# EAGLE design 1A-LaunchPad_MiniProto (EAGLE 5.07)
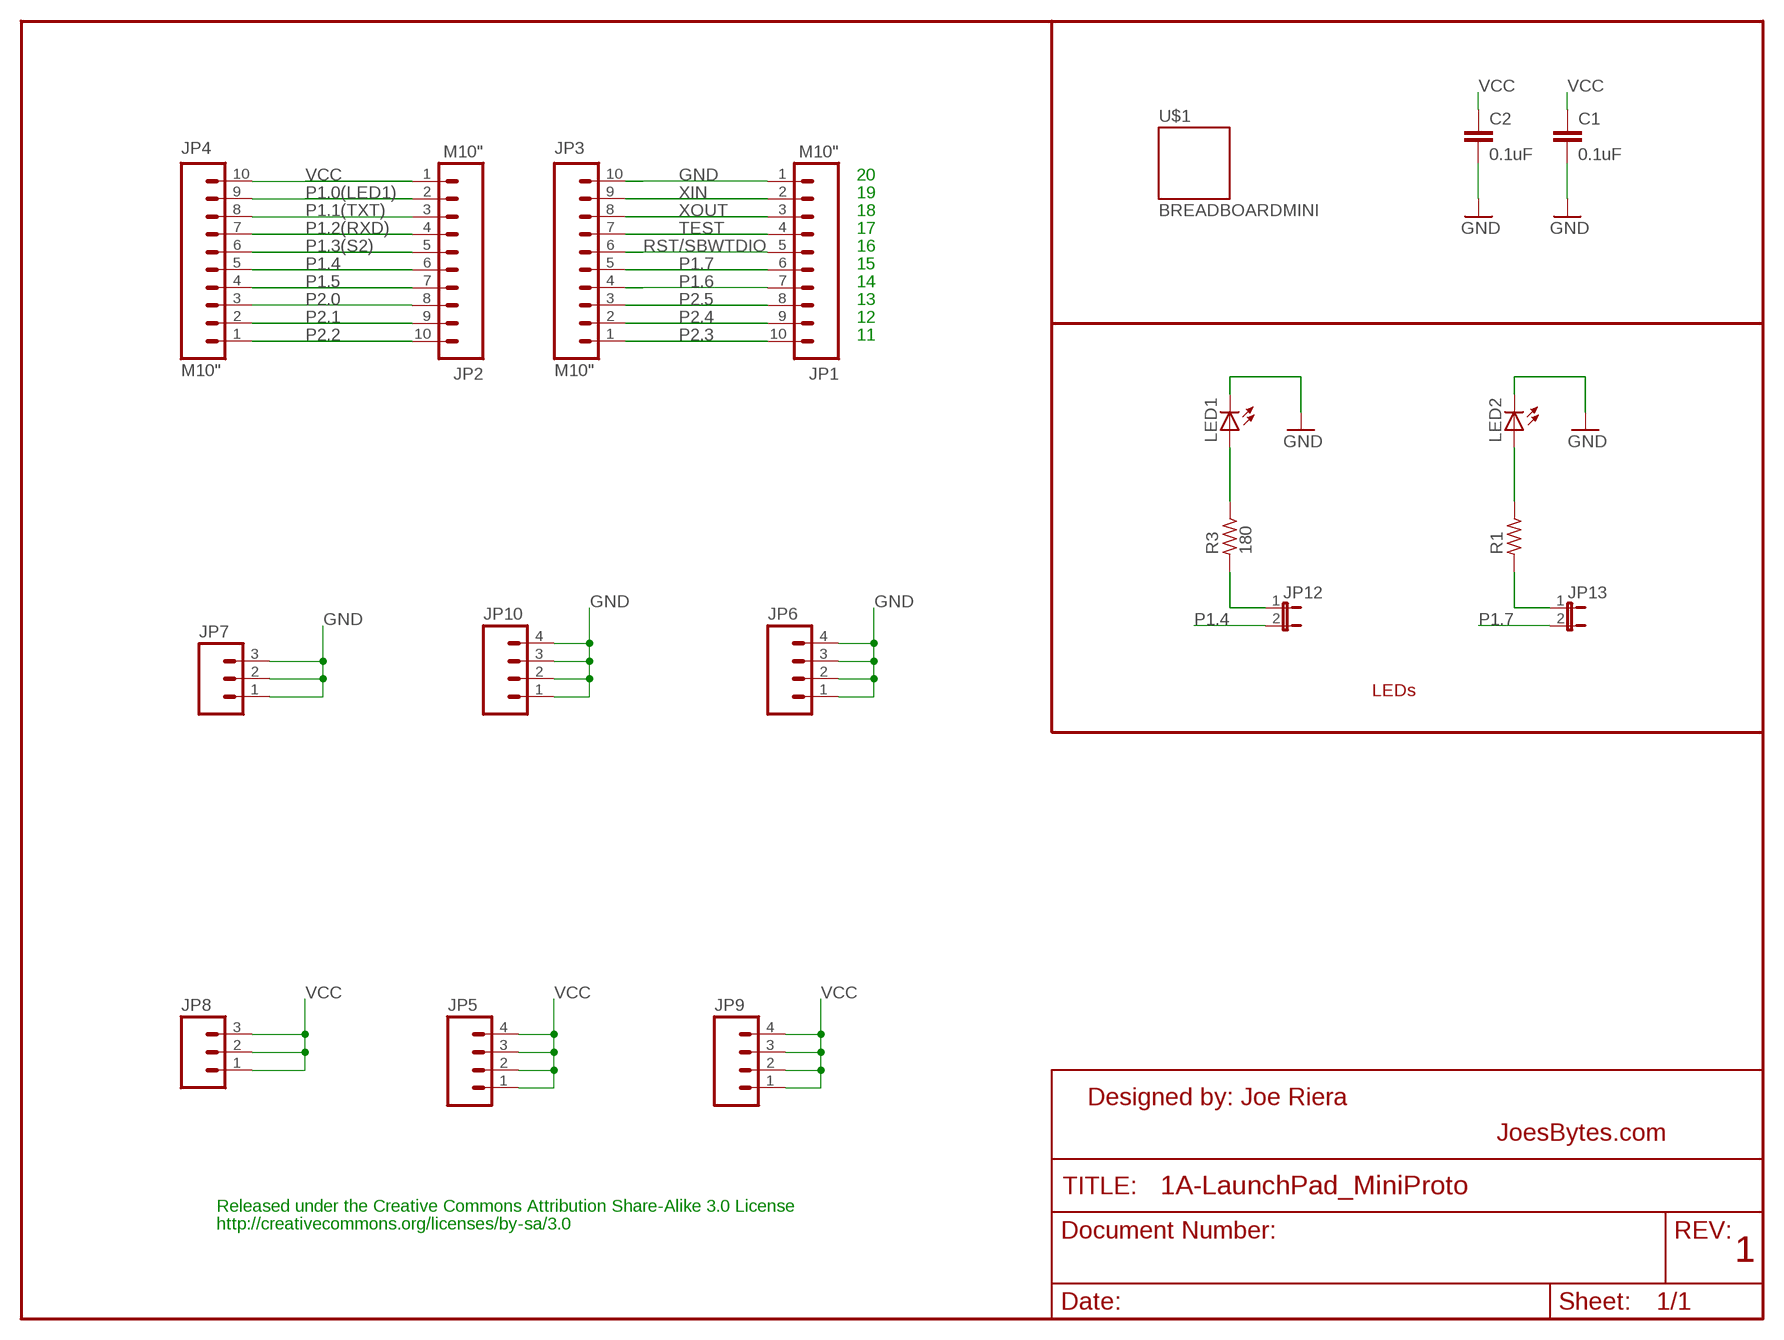
[diagram p0: schematic, sheet 1]

## Parts
C1  0.1uF  CAPPTH  [CAP-PTH-SMALL]
C2  0.1uF  CAPPTH  [CAP-PTH-SMALL]
JP1  M10"  [1X10]
JP2  M10"  [1X10]
JP3  M10"  [1X10]
JP4  M10"  [1X10]
JP5  M04PTH  [1X04]
JP6  M04PTH  [1X04]
JP7  M03PTH  [1X03]
JP8  M03PTH  [1X03]
JP9  M04PTH  [1X04]
JP10  M04PTH  [1X04]
JP12  JUMPER-2PTH_LOCK  [1X02_LOCK]
JP13  JUMPER-2PTH_LOCK  [1X02_LOCK]
LED1  LED3MM  [LED3MM]
LED2  LED3MM  [LED3MM]
R1  R_X0204/5  [0204/5]
R3  180  R_X0204/5  [0204/5]
U$1  BREADBOARDMINI  [BREADBOARD-MINI]

## Nets
GND: C1.2 C2.2 JP1.1 JP3.10 JP6.1 JP6.2 JP6.3 JP6.4 JP7.1 JP7.2 JP7.3 JP10.1 JP10.2 JP10.3 JP10.4 LED1.K(C) LED2.K(C)
N$188: LED1.A R3.2
N$204: JP12.1 R3.1
N$205: LED2.A R1.2
N$220: JP13.1 R1.1
P1.0(LED1): JP2.2 JP4.9
P1.1(TXT): JP2.3 JP4.8
P1.2(RXD): JP2.4 JP4.7
P1.3(S2): JP2.5 JP4.6
P1.4: JP2.6 JP4.5 JP12.2
P1.5: JP2.7 JP4.4
P1.6: JP1.7 JP3.4
P1.7: JP1.6 JP3.5 JP13.2
P2.0: JP2.8 JP4.3
P2.1: JP2.9 JP4.2
P2.2: JP2.10 JP4.1
P2.3: JP1.10 JP3.1
P2.4: JP1.9 JP3.2
P2.5: JP1.8 JP3.3
RST/SBWTDIO: JP1.5 JP3.6
TEST: JP1.4 JP3.7
VCC: C1.1 C2.1 JP2.1 JP4.10 JP5.1 JP5.2 JP5.3 JP5.4 JP8.1 JP8.2 JP8.3 JP9.1 JP9.2 JP9.3 JP9.4
XIN: JP1.2 JP3.9
XOUT: JP1.3 JP3.8

## Notes on the sheet
- 20
- 19
- 18
- 17
- 16
- 15
- 14
- 13
- 12
- 11
- LEDs
- Designed by: Joe Riera
- JoesBytes.com
- Released under the Creative Commons Attribution Share-Alike 3.0 License
- http://creativecommons.org/licenses/by-sa/3.0
- 1

## Library data of the parts
C1 C2 = SparkFun:CAP: Capacitor Standard 0603 ceramic capacitor, and 0.1" leaded capacitor.
JP1-JP4 = SparkFun:M10: Header 10 Standard 10-pin 0.1" header. Use with straight break away headers (SKU : PRT-00116), right angle break away headers (PRT-00553), swiss pins (PRT-00743), machine pins (PRT-00117), and female headers (PRT-00115).
JP5 JP6 JP9 JP10 = SparkFun:M04: Header 4 Standard 4-pin 0.1" header. Use with straight break away headers (SKU : PRT-00116), right angle break away headers (PRT-00553), swiss pins (PRT-00743), machine pins (PRT-00117), and female headers (PRT-00115). Molex polarized connector foot print use with SKU : PRT-08231 with associated crimp pins and housings.
JP7 JP8 = SparkFun:M03: Header 3 Standard 3-pin 0.1" header. Use with straight break away headers (SKU : PRT-00116), right angle break away headers (PRT-00553), swiss pins (PRT-00743), machine pins (PRT-00117), and female headers (PRT-00115). Molex polarized connector foot print use with SKU : PRT-08232 with associated crimp pins and housings.
JP12 JP13 = SparkFun:JUMPER-2: Jumper Basic 0.1" spaced jumper. Use with breakaway headers.
LED1 LED2 = SparkFun:LED: LEDs Standard schematic elements and footprints for 5mm, 3mm, 1206, and 0603 sized LEDs. 5mm - Spark Fun Electronics SKU : COM-00529 (and others)
R1 R3 = rc-master:R_: RESISTOR
U$1 = SparkFun:BREADBOARD: Breadboard Mini Self Adhesive This is the mechnical outline for the very small self adhesive breadboard from SparkFun Electronics. Good for very small proto areas. SKU : PRT-07916

## Board
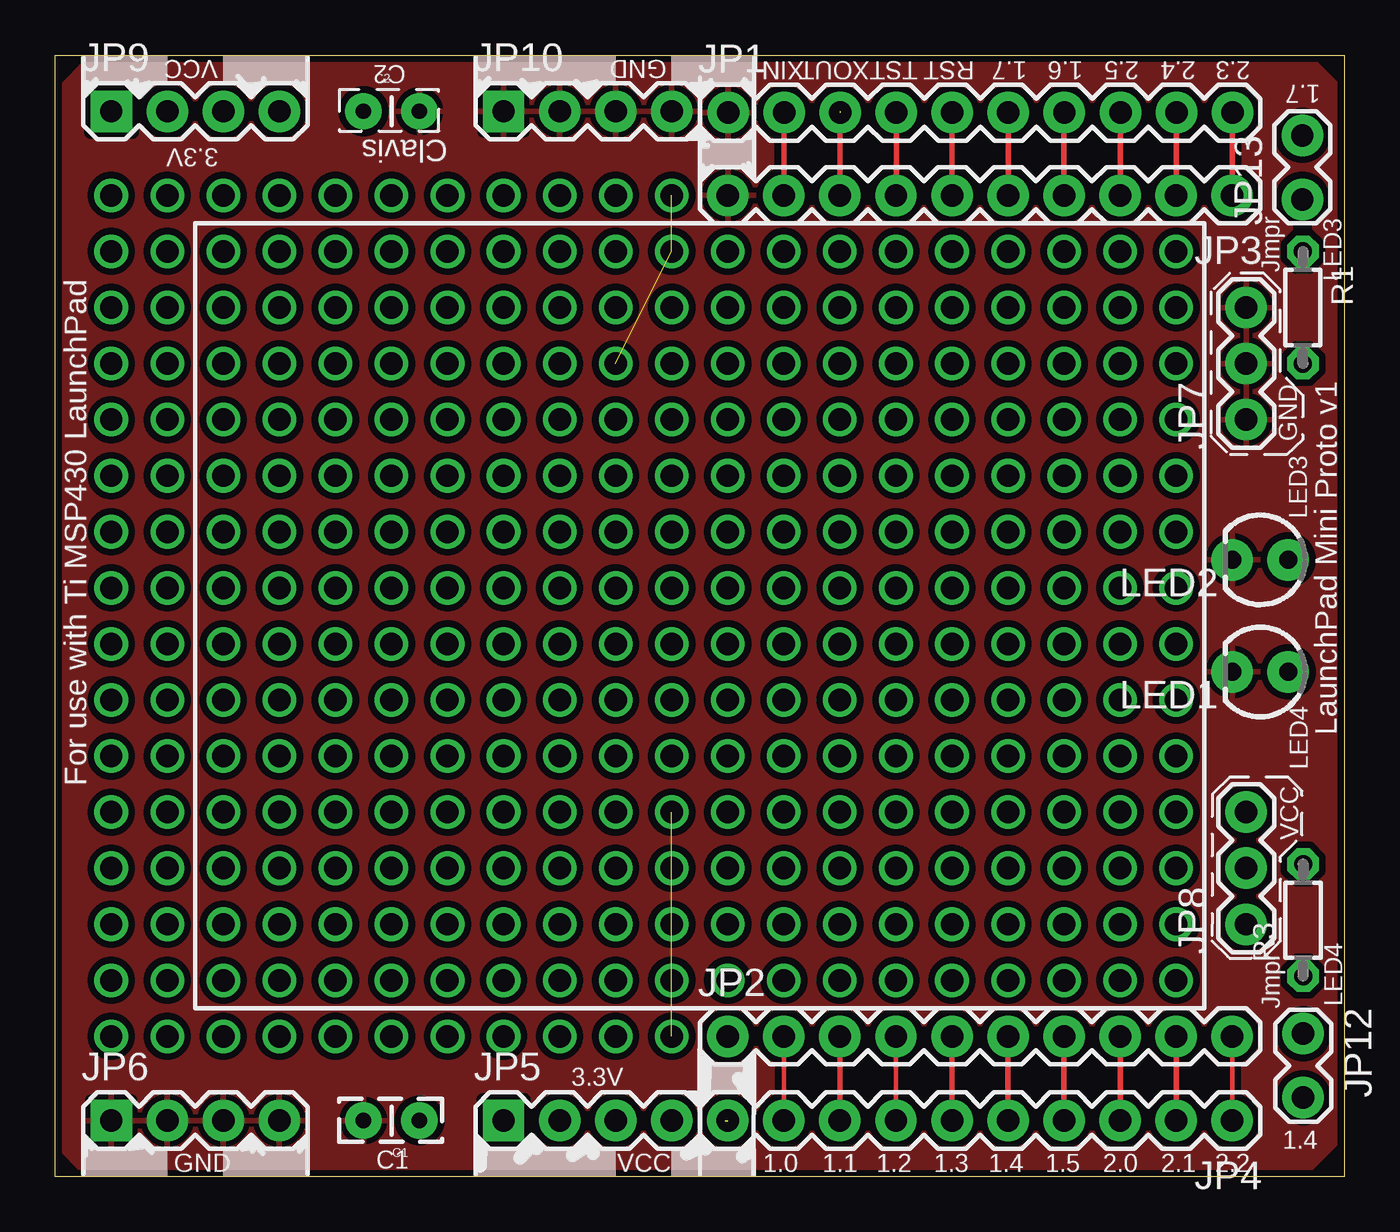
[diagram p1: board, top side]
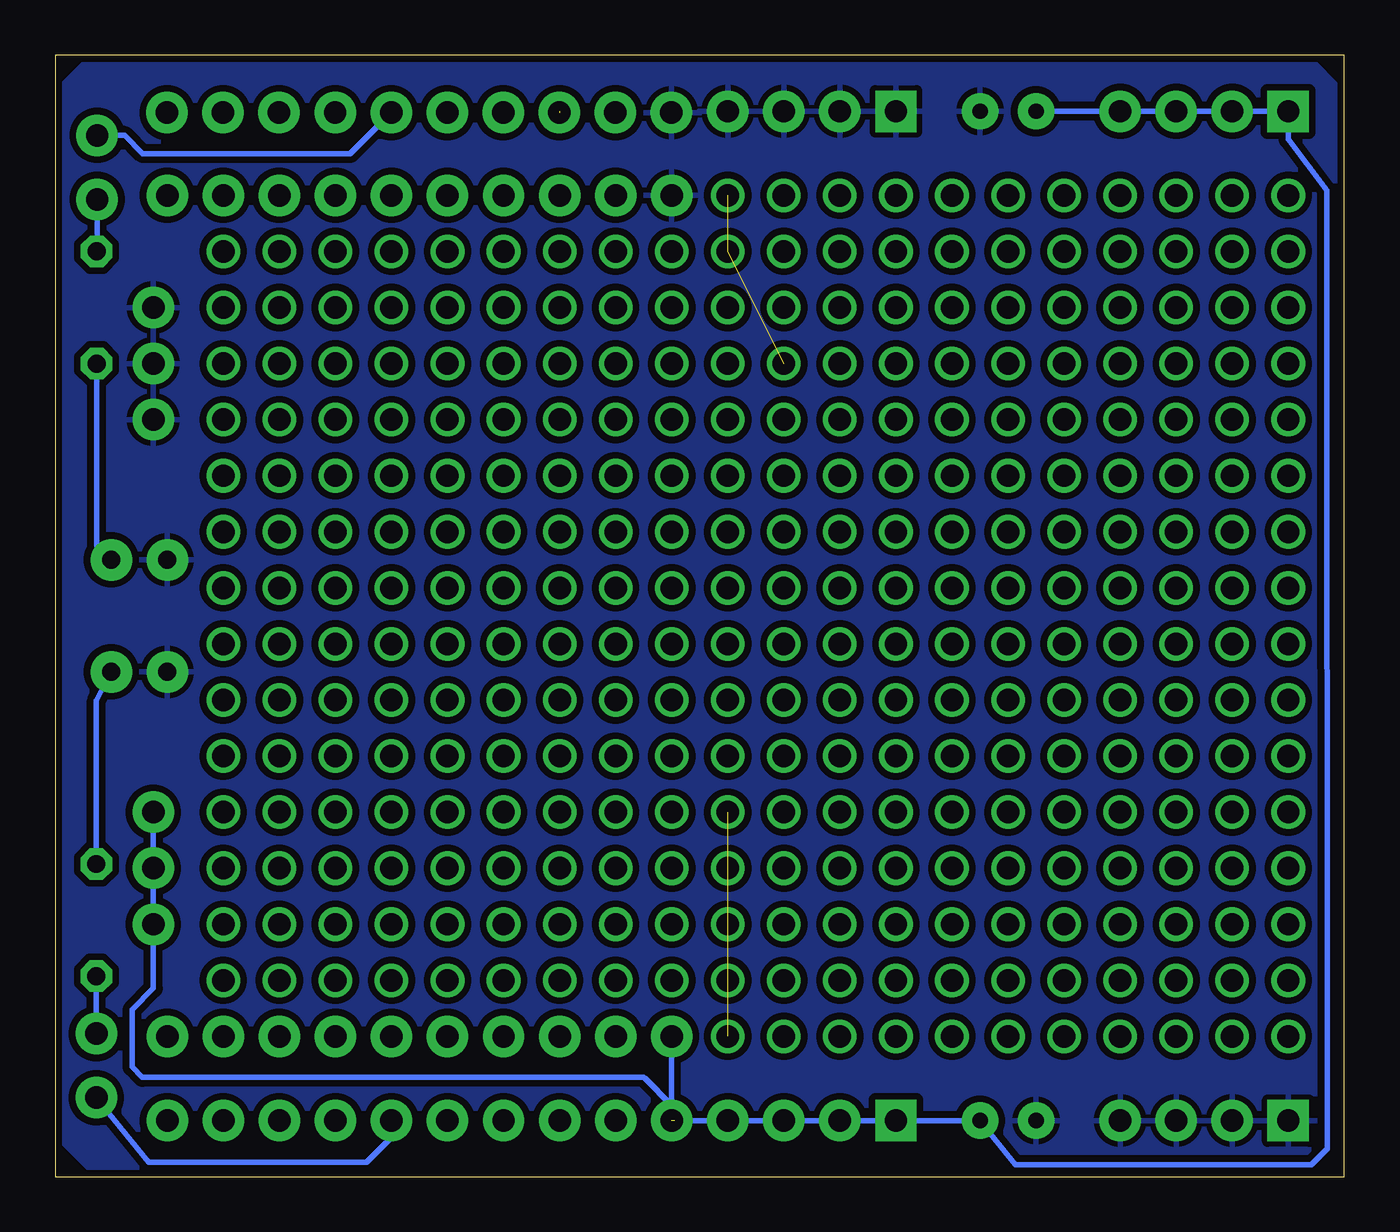
[diagram p2: board, bottom side, seen from below]

Size 58.42 x 50.8 mm. Coordinates in mm from the lower left corner, seen from the top.
Outline: 0,0 0,50.8 58.42,50.8 58.42,0 0,0
Copper layers (1*16): Top 0.035mm / dielectric 1.5mm / Bottom 0.035mm
Design rules "SparkFun": minimum track width 8mil, minimum drill 20mil, track to track 8mil, track to pad 8mil, pad to pad 8mil, via to via 8mil, smd to smd 8mil, copper to edge 10mil, drill to drill 8mil, minimum pad ring 12mil, minimum via ring 10mil, stop-mask expansion 4mil, vias tented up to drill 25mil, thermal gap 10mil

### Footprints (pad centres in the part's own frame; a part is rotated, then mirrored left to right if it is on the bottom)
CAP-PTH-SMALL = drill 0.7 pad 1.651 round: 1 0,0; 2 2.54,0
1X10 = drill 1.016 pad 1.88 round: 1 0,0; 2 2.54,0; 3 5.08,0; 4 7.62,0; 5 10.16,0; 6 12.7,0; 7 15.24,0; 8 17.78,0; 9 20.32,0; 10 22.86,0
1X04 = drill 1.016 pad 1.88 square: 1 0,0 | drill 1.016 pad 1.88 round: 2 2.54,0; 3 5.08,0; 4 7.62,0
1X03 = drill 1.016 pad 1.88 round: 1 0,0; 2 2.54,0; 3 5.08,0
1X02_LOCK = drill 1.016 pad 1.88 round: 1 -0.178,0; 2 2.718,0
LED3MM = drill 0.813 pad 1.88 round: A -1.27,0; K 1.27,0
0204/5 = drill 0.813 pad 1.422 octagon: 1 -2.54,0; 2 2.54,0

### Placement (x,y rotation side)
C1  16.51,2.54 180 top
C2  13.97,48.26 0 top
JP1  30.49,48.2 0 top
JP2  30.48,6.35 0 top
JP3  53.34,44.45 180 top
JP4  53.34,2.54 180 top
JP5  20.32,2.54 0 top
JP6  2.54,2.54 0 top
JP7  53.98,34.29 90 top
JP8  53.98,11.43 90 top
JP9  2.54,48.26 0 top
JP10  20.32,48.26 0 top
JP12  56.55,6.3 270 top
JP13  56.52,44.45 90 top
LED1  54.61,22.86 180 top
LED2  54.61,27.94 180 top
R1  56.54,39.37 270 top
R3  56.55,11.62 90 top
U$1  6.35,7.62 0 top

### Tracks (layer width: path | path; a pad name or v marks a point on that pad's centre or on a via)
GND
  pour Top (isolate 0.305): 1.75,50.81 56.71,50.81 58.46,49.06 58.46,1.96 56.5,0 1.55,0 0,1.55 0,49.06
  pour Bottom (isolate 0.305): 1.75,50.81 56.71,50.81 58.46,49.06 58.46,1.96 56.5,0 1.55,0 0,1.55 0,49.06
N$2  (via drill 1.02 pad 1.52)
  other vias: 5.08,41.91
N$3  (via drill 1.02 pad 1.52)
  other vias: 7.62,41.91
N$5  (via drill 1.02 pad 1.52)
  other vias: 50.8,21.59
N$7  (via drill 1.02 pad 1.52)
  other vias: 10.16,41.91
N$8  (via drill 1.02 pad 1.52)
  other vias: 10.16,39.37
N$13  (via drill 1.02 pad 1.52)
  other vias: 48.26,39.37
N$15  (via drill 1.02 pad 1.52)
  other vias: 2.54,41.91
N$16  (via drill 1.02 pad 1.52)
  other vias: 2.54,39.37
N$17  (via drill 1.02 pad 1.52)
  other vias: 2.54,31.75
N$18  (via drill 1.02 pad 1.52)
  other vias: 2.54,34.29
N$19  (via drill 1.02 pad 1.52)
  other vias: 2.54,36.83
N$20  (via drill 1.02 pad 1.52)
  other vias: 12.7,44.45
N$21  (via drill 1.02 pad 1.52)
  other vias: 15.24,44.45
N$22  (via drill 1.02 pad 1.52)
  other vias: 17.78,44.45
N$23  (via drill 1.02 pad 1.52)
  other vias: 20.32,44.45
N$24  (via drill 1.02 pad 1.52)
  other vias: 22.86,44.45
N$25  (via drill 1.02 pad 1.52)
  other vias: 45.72,39.37
N$26  (via drill 1.02 pad 1.52)
  other vias: 43.18,39.37
N$27  (via drill 1.02 pad 1.52)
  other vias: 40.64,39.37
N$28  (via drill 1.02 pad 1.52)
  other vias: 38.1,39.37
N$29  (via drill 1.02 pad 1.52)
  other vias: 35.56,39.37
N$30  (via drill 1.02 pad 1.52)
  other vias: 33.02,39.37
N$31  (via drill 1.02 pad 1.52)
  other vias: 30.48,39.37
N$32  (via drill 1.02 pad 1.52)
  other vias: 30.48,41.91
N$33  (via drill 1.02 pad 1.52)
  other vias: 7.62,39.37
N$34  (via drill 1.02 pad 1.52)
  other vias: 5.08,39.37
N$35  (via drill 1.02 pad 1.52)
  other vias: 5.08,31.75
N$36  (via drill 1.02 pad 1.52)
  other vias: 7.62,31.75
N$37  (via drill 1.02 pad 1.52)
  other vias: 10.16,31.75
N$38  (via drill 1.02 pad 1.52)
  other vias: 10.16,34.29
N$39  (via drill 1.02 pad 1.52)
  other vias: 7.62,34.29
N$40  (via drill 1.02 pad 1.52)
  other vias: 5.08,34.29
N$41  (via drill 1.02 pad 1.52)
  other vias: 30.48,31.75
N$42  (via drill 1.02 pad 1.52)
  other vias: 33.02,31.75
N$43  (via drill 1.02 pad 1.52)
  other vias: 35.56,31.75
N$44  (via drill 1.02 pad 1.52)
  other vias: 38.1,31.75
N$45  (via drill 1.02 pad 1.52)
  other vias: 40.64,31.75
N$46  (via drill 1.02 pad 1.52)
  other vias: 43.18,31.75
N$47  (via drill 1.02 pad 1.52)
  other vias: 45.72,31.75
N$48  (via drill 1.02 pad 1.52)
  other vias: 48.26,31.75
N$49  (via drill 1.02 pad 1.52)
  other vias: 48.26,34.29
N$50  (via drill 1.02 pad 1.52)
  other vias: 45.72,34.29
N$51  (via drill 1.02 pad 1.52)
  other vias: 43.18,34.29
N$52  (via drill 1.02 pad 1.52)
  other vias: 40.64,34.29
N$53  (via drill 1.02 pad 1.52)
  other vias: 38.1,34.29
N$54  (via drill 1.02 pad 1.52)
  other vias: 35.56,34.29
N$55  (via drill 1.02 pad 1.52)
  other vias: 33.02,34.29
N$56  (via drill 1.02 pad 1.52)
  other vias: 30.48,34.29
N$57  (via drill 1.02 pad 1.52)
  other vias: 5.08,36.83
N$58  (via drill 1.02 pad 1.52)
  other vias: 7.62,36.83
N$59  (via drill 1.02 pad 1.52)
  other vias: 10.16,36.83
N$60  (via drill 1.02 pad 1.52)
  other vias: 10.16,29.21
N$61  (via drill 1.02 pad 1.52)
  other vias: 7.62,29.21
N$62  (via drill 1.02 pad 1.52)
  other vias: 5.08,29.21
N$63  (via drill 1.02 pad 1.52)
  other vias: 5.08,26.67
N$64  (via drill 1.02 pad 1.52)
  other vias: 7.62,26.67
N$65  (via drill 1.02 pad 1.52)
  other vias: 30.48,36.83
N$66  (via drill 1.02 pad 1.52)
  other vias: 33.02,36.83
N$67  (via drill 1.02 pad 1.52)
  other vias: 35.56,36.83
N$68  (via drill 1.02 pad 1.52)
  other vias: 38.1,36.83
N$69  (via drill 1.02 pad 1.52)
  other vias: 40.64,36.83
N$70  (via drill 1.02 pad 1.52)
  other vias: 43.18,36.83
N$71  (via drill 1.02 pad 1.52)
  other vias: 45.72,36.83
N$72  (via drill 1.02 pad 1.52)
  other vias: 48.26,36.83
N$73  (via drill 1.02 pad 1.52)
  other vias: 48.26,29.21
N$74  (via drill 1.02 pad 1.52)
  other vias: 45.72,29.21
N$75  (via drill 1.02 pad 1.52)
  other vias: 43.18,29.21
N$76  (via drill 1.02 pad 1.52)
  other vias: 40.64,29.21
N$77  (via drill 1.02 pad 1.52)
  other vias: 38.1,29.21
N$78  (via drill 1.02 pad 1.52)
  other vias: 35.56,29.21
N$79  (via drill 1.02 pad 1.52)
  other vias: 33.02,29.21
N$80  (via drill 1.02 pad 1.52)
  other vias: 30.48,29.21
N$81  (via drill 1.02 pad 1.52)
  other vias: 10.16,26.67
N$82  (via drill 1.02 pad 1.52)
  other vias: 10.16,24.13
N$83  (via drill 1.02 pad 1.52)
  other vias: 7.62,24.13
N$84  (via drill 1.02 pad 1.52)
  other vias: 5.08,24.13
N$85  (via drill 1.02 pad 1.52)
  other vias: 5.08,16.51
N$86  (via drill 1.02 pad 1.52)
  other vias: 7.62,16.51
N$87  (via drill 1.02 pad 1.52)
  other vias: 10.16,16.51
N$88  (via drill 1.02 pad 1.52)
  other vias: 10.16,19.05
N$89  (via drill 1.02 pad 1.52)
  other vias: 30.48,26.67
N$90  (via drill 1.02 pad 1.52)
  other vias: 33.02,26.67
N$91  (via drill 1.02 pad 1.52)
  other vias: 35.56,26.67
N$92  (via drill 1.02 pad 1.52)
  other vias: 38.1,26.67
N$93  (via drill 1.02 pad 1.52)
  other vias: 40.64,26.67
N$94  (via drill 1.02 pad 1.52)
  other vias: 43.18,26.67
N$95  (via drill 1.02 pad 1.52)
  other vias: 45.72,26.67
N$96  (via drill 1.02 pad 1.52)
  other vias: 48.26,26.67
N$97  (via drill 1.02 pad 1.52)
  other vias: 48.26,24.13
N$98  (via drill 1.02 pad 1.52)
  other vias: 45.72,24.13
N$99  (via drill 1.02 pad 1.52)
  other vias: 43.18,24.13
N$100  (via drill 1.02 pad 1.52)
  other vias: 40.64,24.13
N$101  (via drill 1.02 pad 1.52)
  other vias: 38.1,24.13
N$102  (via drill 1.02 pad 1.52)
  other vias: 35.56,24.13
N$103  (via drill 1.02 pad 1.52)
  other vias: 33.02,24.13
N$104  (via drill 1.02 pad 1.52)
  other vias: 30.48,24.13
N$105  (via drill 1.02 pad 1.52)
  other vias: 7.62,19.05
N$106  (via drill 1.02 pad 1.52)
  other vias: 5.08,19.05
N$107  (via drill 1.02 pad 1.52)
  other vias: 5.08,21.59
N$108  (via drill 1.02 pad 1.52)
  other vias: 7.62,21.59
N$109  (via drill 1.02 pad 1.52)
  other vias: 10.16,21.59
N$110  (via drill 1.02 pad 1.52)
  other vias: 5.08,8.89
N$111  (via drill 1.02 pad 1.52)
  other vias: 7.62,8.89
N$112  (via drill 1.02 pad 1.52)
  other vias: 10.16,8.89
N$113  (via drill 1.02 pad 1.52)
  other vias: 30.48,16.51
N$114  (via drill 1.02 pad 1.52)
  other vias: 33.02,16.51
N$115  (via drill 1.02 pad 1.52)
  other vias: 35.56,16.51
N$116  (via drill 1.02 pad 1.52)
  other vias: 38.1,16.51
N$117  (via drill 1.02 pad 1.52)
  other vias: 40.64,16.51
N$118  (via drill 1.02 pad 1.52)
  other vias: 43.18,16.51
N$119  (via drill 1.02 pad 1.52)
  other vias: 45.72,16.51
N$120  (via drill 1.02 pad 1.52)
  other vias: 48.26,16.51
N$121  (via drill 1.02 pad 1.52)
  other vias: 48.26,19.05
N$122  (via drill 1.02 pad 1.52)
  other vias: 45.72,19.05
N$123  (via drill 1.02 pad 1.52)
  other vias: 43.18,19.05
N$124  (via drill 1.02 pad 1.52)
  other vias: 40.64,19.05
N$125  (via drill 1.02 pad 1.52)
  other vias: 38.1,19.05
N$126  (via drill 1.02 pad 1.52)
  other vias: 35.56,19.05
N$127  (via drill 1.02 pad 1.52)
  other vias: 33.02,19.05
N$128  (via drill 1.02 pad 1.52)
  other vias: 30.48,19.05
N$129  (via drill 1.02 pad 1.52)
  other vias: 10.16,11.43
N$130  (via drill 1.02 pad 1.52)
  other vias: 7.62,11.43
N$131  (via drill 1.02 pad 1.52)
  other vias: 5.08,11.43
N$132  (via drill 1.02 pad 1.52)
  other vias: 5.08,13.97
N$133  (via drill 1.02 pad 1.52)
  other vias: 7.62,13.97
N$134  (via drill 1.02 pad 1.52)
  other vias: 10.16,13.97
N$135  (via drill 1.02 pad 1.52)
  other vias: 2.54,29.21
N$136  (via drill 1.02 pad 1.52)
  other vias: 2.54,26.67
N$137  (via drill 1.02 pad 1.52)
  other vias: 30.48,21.59
N$138  (via drill 1.02 pad 1.52)
  other vias: 33.02,21.59
N$139  (via drill 1.02 pad 1.52)
  other vias: 35.56,21.59
N$140  (via drill 1.02 pad 1.52)
  other vias: 38.1,21.59
N$141  (via drill 1.02 pad 1.52)
  other vias: 40.64,21.59
N$142  (via drill 1.02 pad 1.52)
  other vias: 43.18,21.59
N$143  (via drill 1.02 pad 1.52)
  other vias: 45.72,21.59
N$144  (via drill 1.02 pad 1.52)
  other vias: 48.26,21.59
N$145  (via drill 1.02 pad 1.52)
  other vias: 2.54,24.13
N$146  (via drill 1.02 pad 1.52)
  other vias: 5.08,44.45
N$147  (via drill 1.02 pad 1.52)
  other vias: 25.4,44.45
N$148  (via drill 1.02 pad 1.52)
  other vias: 33.02,41.91
N$149  (via drill 1.02 pad 1.52)
  other vias: 7.62,44.45
N$150  (via drill 1.02 pad 1.52)
  other vias: 10.16,44.45
N$151  (via drill 1.02 pad 1.52)
  other vias: 2.54,16.51
N$152  (via drill 1.02 pad 1.52)
  other vias: 2.54,19.05
N$153  (via drill 1.02 pad 1.52)
  other vias: 2.54,21.59
N$154  (via drill 1.02 pad 1.52)
  other vias: 2.54,8.89
N$155  (via drill 1.02 pad 1.52)
  other vias: 2.54,11.43
N$156  (via drill 1.02 pad 1.52)
  other vias: 2.54,13.97
N$157  (via drill 1.02 pad 1.52)
  other vias: 35.56,41.91
N$158  (via drill 1.02 pad 1.52)
  other vias: 38.1,41.91
N$159  (via drill 1.02 pad 1.52)
  other vias: 40.64,41.91
N$160  (via drill 1.02 pad 1.52)
  other vias: 43.18,41.91
N$161  (via drill 1.02 pad 1.52)
  other vias: 45.72,41.91
N$162  (via drill 1.02 pad 1.52)
  other vias: 48.26,41.91
N$163  (via drill 1.02 pad 1.52)
  other vias: 27.94,39.37
N$165  (via drill 1.02 pad 1.52)
  other vias: 2.54,44.45
N$166  (via drill 1.02 pad 1.52)
  other vias: 2.54,6.35
N$168  (via drill 1.02 pad 1.52)
  other vias: 10.16,6.35
N$169  (via drill 1.02 pad 1.52)
  other vias: 7.62,6.35
N$170  (via drill 1.02 pad 1.52)
  other vias: 5.08,6.35
N$171  (via drill 1.02 pad 1.52)
  other vias: 50.8,39.37
N$172  (via drill 1.02 pad 1.52)
  other vias: 50.8,41.91
N$173  (via drill 1.02 pad 1.52)
  other vias: 30.48,13.97
N$174  (via drill 1.02 pad 1.52)
  other vias: 33.02,13.97
N$175  (via drill 1.02 pad 1.52)
  other vias: 35.56,13.97
N$176  (via drill 1.02 pad 1.52)
  other vias: 38.1,13.97
N$177  (via drill 1.02 pad 1.52)
  other vias: 40.64,13.97
N$178  (via drill 1.02 pad 1.52)
  other vias: 43.18,13.97
N$179  (via drill 1.02 pad 1.52)
  other vias: 45.72,13.97
N$180  (via drill 1.02 pad 1.52)
  other vias: 48.26,13.97
N$181  (via drill 1.02 pad 1.52)
  other vias: 30.48,11.43
N$182  (via drill 1.02 pad 1.52)
  other vias: 33.02,11.43
N$183  (via drill 1.02 pad 1.52)
  other vias: 25.4,6.35
N$184  (via drill 1.02 pad 1.52)
  other vias: 22.86,6.35
N$185  (via drill 1.02 pad 1.52)
  other vias: 20.32,6.35
N$186  (via drill 1.02 pad 1.52)
  other vias: 17.78,6.35
N$187  (via drill 1.02 pad 1.52)
  other vias: 15.24,6.35
N$188
  Bottom 0.254: R3.2 56.55,21.55 LED1.A
N$189  (via drill 1.02 pad 1.52)
  other vias: 12.7,6.35
N$190  (via drill 1.02 pad 1.52)
  other vias: 12.7,41.91
N$191  (via drill 1.02 pad 1.52)
  other vias: 15.24,41.91
N$192  (via drill 1.02 pad 1.52)
  other vias: 17.78,41.91
N$193  (via drill 1.02 pad 1.52)
  other vias: 20.32,41.91
N$194  (via drill 1.02 pad 1.52)
  other vias: 22.86,41.91
N$195  (via drill 1.02 pad 1.52)
  other vias: 25.4,41.91
N$196  (via drill 1.02 pad 1.52)
  other vias: 35.56,11.43
N$197  (via drill 1.02 pad 1.52)
  other vias: 38.1,11.43
N$198  (via drill 1.02 pad 1.52)
  other vias: 25.4,39.37
N$199  (via drill 1.02 pad 1.52)
  other vias: 22.86,39.37
N$200  (via drill 1.02 pad 1.52)
  other vias: 20.32,39.37
N$201  (via drill 1.02 pad 1.52)
  other vias: 17.78,39.37
N$202  (via drill 1.02 pad 1.52)
  other vias: 15.24,39.37
N$203  (via drill 1.02 pad 1.52)
  other vias: 12.7,39.37
N$204
  Bottom 0.254: JP12.1 R3.1
N$205
  Bottom 0.254: R1.2 56.54,28.6 LED2.A
N$206  (via drill 1.02 pad 1.52)
  other vias: 12.7,31.75
N$207  (via drill 1.02 pad 1.52)
  other vias: 15.24,31.75
N$208  (via drill 1.02 pad 1.52)
  other vias: 17.78,31.75
N$209  (via drill 1.02 pad 1.52)
  other vias: 20.32,31.75
N$210  (via drill 1.02 pad 1.52)
  other vias: 22.86,31.75
N$211  (via drill 1.02 pad 1.52)
  other vias: 25.4,31.75
N$212  (via drill 1.02 pad 1.52)
  other vias: 27.94,31.75
N$213  (via drill 1.02 pad 1.52)
  other vias: 27.94,34.29
N$214  (via drill 1.02 pad 1.52)
  other vias: 25.4,34.29
N$215  (via drill 1.02 pad 1.52)
  other vias: 22.86,34.29
N$216  (via drill 1.02 pad 1.52)
  other vias: 20.32,34.29
N$217  (via drill 1.02 pad 1.52)
  other vias: 17.78,34.29
N$218  (via drill 1.02 pad 1.52)
  other vias: 15.24,34.29
N$219  (via drill 1.02 pad 1.52)
  other vias: 12.7,34.29
N$220
  Bottom 0.254: JP13.1 56.52,41.94 R1.1
N$222  (via drill 1.02 pad 1.52)
  other vias: 12.7,36.83
N$223  (via drill 1.02 pad 1.52)
  other vias: 15.24,36.83
N$224  (via drill 1.02 pad 1.52)
  other vias: 17.78,36.83
N$225  (via drill 1.02 pad 1.52)
  other vias: 20.32,36.83
N$226  (via drill 1.02 pad 1.52)
  other vias: 22.86,36.83
N$227  (via drill 1.02 pad 1.52)  (2 unrouted)
  other vias: 25.4,36.83 27.94,41.91 27.94,44.45
N$228  (via drill 1.02 pad 1.52)
  other vias: 27.94,36.83
N$229  (via drill 1.02 pad 1.52)
  other vias: 27.94,29.21
N$230  (via drill 1.02 pad 1.52)
  other vias: 25.4,29.21
N$231  (via drill 1.02 pad 1.52)
  other vias: 22.86,29.21
N$232  (via drill 1.02 pad 1.52)
  other vias: 20.32,29.21
N$233  (via drill 1.02 pad 1.52)
  other vias: 17.78,29.21
N$234  (via drill 1.02 pad 1.52)
  other vias: 15.24,29.21
N$235  (via drill 1.02 pad 1.52)
  other vias: 12.7,29.21
N$238  (via drill 1.02 pad 1.52)
  other vias: 12.7,26.67
N$239  (via drill 1.02 pad 1.52)
  other vias: 15.24,26.67
N$240  (via drill 1.02 pad 1.52)
  other vias: 17.78,26.67
N$241  (via drill 1.02 pad 1.52)
  other vias: 20.32,26.67
N$242  (via drill 1.02 pad 1.52)
  other vias: 22.86,26.67
N$243  (via drill 1.02 pad 1.52)
  other vias: 25.4,26.67
N$244  (via drill 1.02 pad 1.52)
  other vias: 27.94,26.67
N$245  (via drill 1.02 pad 1.52)
  other vias: 27.94,24.13
N$246  (via drill 1.02 pad 1.52)
  other vias: 25.4,24.13
N$247  (via drill 1.02 pad 1.52)
  other vias: 22.86,24.13
N$248  (via drill 1.02 pad 1.52)
  other vias: 20.32,24.13
N$249  (via drill 1.02 pad 1.52)
  other vias: 17.78,24.13
N$250  (via drill 1.02 pad 1.52)
  other vias: 15.24,24.13
N$251  (via drill 1.02 pad 1.52)
  other vias: 12.7,24.13
N$254  (via drill 1.02 pad 1.52)
  other vias: 12.7,16.51
N$255  (via drill 1.02 pad 1.52)
  other vias: 15.24,16.51
N$256  (via drill 1.02 pad 1.52)
  other vias: 17.78,16.51
N$257  (via drill 1.02 pad 1.52)
  other vias: 20.32,16.51
N$258  (via drill 1.02 pad 1.52)
  other vias: 22.86,16.51
N$259  (via drill 1.02 pad 1.52)
  other vias: 25.4,16.51
N$260  (via drill 1.02 pad 1.52)  (2 unrouted)
  other vias: 27.94,16.51 27.94,8.89 27.94,6.35
N$261  (via drill 1.02 pad 1.52)
  other vias: 27.94,19.05
N$262  (via drill 1.02 pad 1.52)
  other vias: 25.4,19.05
N$263  (via drill 1.02 pad 1.52)
  other vias: 22.86,19.05
N$264  (via drill 1.02 pad 1.52)
  other vias: 20.32,19.05
N$265  (via drill 1.02 pad 1.52)
  other vias: 17.78,19.05
N$266  (via drill 1.02 pad 1.52)
  other vias: 15.24,19.05
N$267  (via drill 1.02 pad 1.52)
  other vias: 12.7,19.05
N$270  (via drill 1.02 pad 1.52)
  other vias: 12.7,21.59
N$271  (via drill 1.02 pad 1.52)
  other vias: 15.24,21.59
N$272  (via drill 1.02 pad 1.52)
  other vias: 17.78,21.59
N$273  (via drill 1.02 pad 1.52)
  other vias: 20.32,21.59
N$274  (via drill 1.02 pad 1.52)
  other vias: 22.86,21.59
N$275  (via drill 1.02 pad 1.52)
  other vias: 25.4,21.59
N$276  (via drill 1.02 pad 1.52)
  other vias: 27.94,21.59
N$277  (via drill 1.02 pad 1.52)
  other vias: 40.64,11.43
N$278  (via drill 1.02 pad 1.52)
  other vias: 12.7,8.89
N$279  (via drill 1.02 pad 1.52)
  other vias: 15.24,8.89
N$280  (via drill 1.02 pad 1.52)
  other vias: 17.78,8.89
N$281  (via drill 1.02 pad 1.52)
  other vias: 20.32,8.89
N$282  (via drill 1.02 pad 1.52)
  other vias: 22.86,8.89
N$283  (via drill 1.02 pad 1.52)
  other vias: 25.4,8.89
N$284  (via drill 1.02 pad 1.52)
  other vias: 43.18,11.43
N$285  (via drill 1.02 pad 1.52)
  other vias: 45.72,11.43
N$286  (via drill 1.02 pad 1.52)
  other vias: 25.4,11.43
N$287  (via drill 1.02 pad 1.52)
  other vias: 22.86,11.43
N$288  (via drill 1.02 pad 1.52)
  other vias: 20.32,11.43
N$289  (via drill 1.02 pad 1.52)
  other vias: 17.78,11.43
N$290  (via drill 1.02 pad 1.52)
  other vias: 15.24,11.43
N$291  (via drill 1.02 pad 1.52)
  other vias: 12.7,11.43
N$292  (via drill 1.02 pad 1.52)
  other vias: 48.26,11.43
N$293  (via drill 1.02 pad 1.52)
  other vias: 30.48,8.89
N$294  (via drill 1.02 pad 1.52)
  other vias: 12.7,13.97
N$295  (via drill 1.02 pad 1.52)
  other vias: 15.24,13.97
N$296  (via drill 1.02 pad 1.52)
  other vias: 17.78,13.97
N$297  (via drill 1.02 pad 1.52)
  other vias: 20.32,13.97
N$298  (via drill 1.02 pad 1.52)
  other vias: 22.86,13.97
N$299  (via drill 1.02 pad 1.52)
  other vias: 25.4,13.97
N$300  (via drill 1.02 pad 1.52)
  other vias: 27.94,13.97
N$301  (via drill 1.02 pad 1.52)
  other vias: 33.02,8.89
N$302  (via drill 1.02 pad 1.52)
  other vias: 35.56,8.89
N$303  (via drill 1.02 pad 1.52)
  other vias: 38.1,8.89
N$304  (via drill 1.02 pad 1.52)
  other vias: 40.64,8.89
N$305  (via drill 1.02 pad 1.52)
  other vias: 43.18,8.89
N$306  (via drill 1.02 pad 1.52)
  other vias: 45.72,8.89
N$307  (via drill 1.02 pad 1.52)
  other vias: 48.26,8.89
N$308  (via drill 1.02 pad 1.52)
  other vias: 27.94,11.43
N$310  (via drill 1.02 pad 1.52)
  other vias: 50.8,11.43
N$311  (via drill 1.02 pad 1.52)
  other vias: 50.8,8.89
N$327  (via drill 1.02 pad 1.52)
  other vias: 50.8,31.75
N$330  (via drill 1.02 pad 1.52)
  other vias: 50.8,34.29
N$331  (via drill 1.02 pad 1.52)
  other vias: 50.8,36.83
N$334  (via drill 1.02 pad 1.52)
  other vias: 50.8,29.21
N$335  (via drill 1.02 pad 1.52)
  other vias: 50.8,26.67
N$338  (via drill 1.02 pad 1.52)
  other vias: 50.8,24.13
N$339  (via drill 1.02 pad 1.52)
  other vias: 50.8,16.51
N$342  (via drill 1.02 pad 1.52)
  other vias: 50.8,19.05
N$349  (via drill 1.02 pad 1.52)
  other vias: 50.8,13.97
P1.0(LED1)
  Top 0.203: JP4.9 JP2.2
P1.1(TXT)
  Top 0.254: JP4.8 JP2.3
P1.2(RXD)
  Top 0.203: JP4.7 JP2.4
P1.3(S2)
  Top 0.254: JP4.6 JP2.5
P1.4
  Top 0.254: JP4.5 JP2.6
  Bottom 0.254: JP12.2 54.18,0.66 44.3,0.66 43.18,1.78 JP4.5
P1.5
  Top 0.254: JP4.4 JP2.7
P1.6
  Top 0.254: 45.73,44.46 JP3.4 45.72,48.18 JP1.7
P1.7
  Top 0.254: JP1.6 43.19,44.46 JP3.5
  Bottom 0.254: JP13.2 55.27,47.17 54.45,46.34 45.05,46.34 JP1.6
P2.0
  Top 0.254: JP4.3 JP2.8
P2.1
  Top 0.254: JP4.2 JP2.9
P2.2
  Top 0.203: JP4.1 JP2.10
P2.3
  Top 0.254: JP1.10 53.35,44.46 JP3.1
P2.4
  Top 0.254: 50.81,44.46 JP3.2 50.8,48.18 JP1.9
P2.5
  Top 0.254: JP1.8 48.27,44.46 JP3.3
RST/SBWTDIO
  Top 0.254: 40.65,44.46 JP3.6 40.64,48.18 JP1.5
TEST
  Top 0.254: JP1.4 38.11,44.46 JP3.7
VCC  (1 unrouted)
  Bottom 0.254: C2.1 JP9.4 JP9.3 JP9.2 JP9.1 2.54,46.99 0.79,44.68 0.78,1.27 1.5,0.55 14.91,0.55 C1.1 JP5.1 JP5.2 JP5.3 JP5.4 30.35,2.54 | JP8.3 JP8.2 JP8.1 53.98,8.52 54.94,7.56 54.94,4.97 54.47,4.5 31.75,4.5 31.7,4.45 30.48,3.23 JP4.10 JP2.1
XIN
  Top 0.254: JP1.2 33.03,44.46 JP3.9
XOUT  (1 unrouted)
  Top 0.254: JP3.8 35.56,48.26

### Text on the board
tPlace: VCC | GND | XIN | XOUT | TST | RST | 1.7 | 1.6 | 2.5 | 2.4 | 2.3 | C2 | 1.7 | 3.3V | Clavis | For use with Ti MSP430 LaunchPad | Jmpr | LED3 | LaunchPad Mini Proto v1 | GND | LED3 | LED4 | VCC | LED4 | Jmpr | 3.3V | VCC | 1.4 | GND | C1 | 1.0 | 1.1 | 1.2 | 1.3 | 1.4 | 1.5 | 2.0 | 2.1 | 2.2